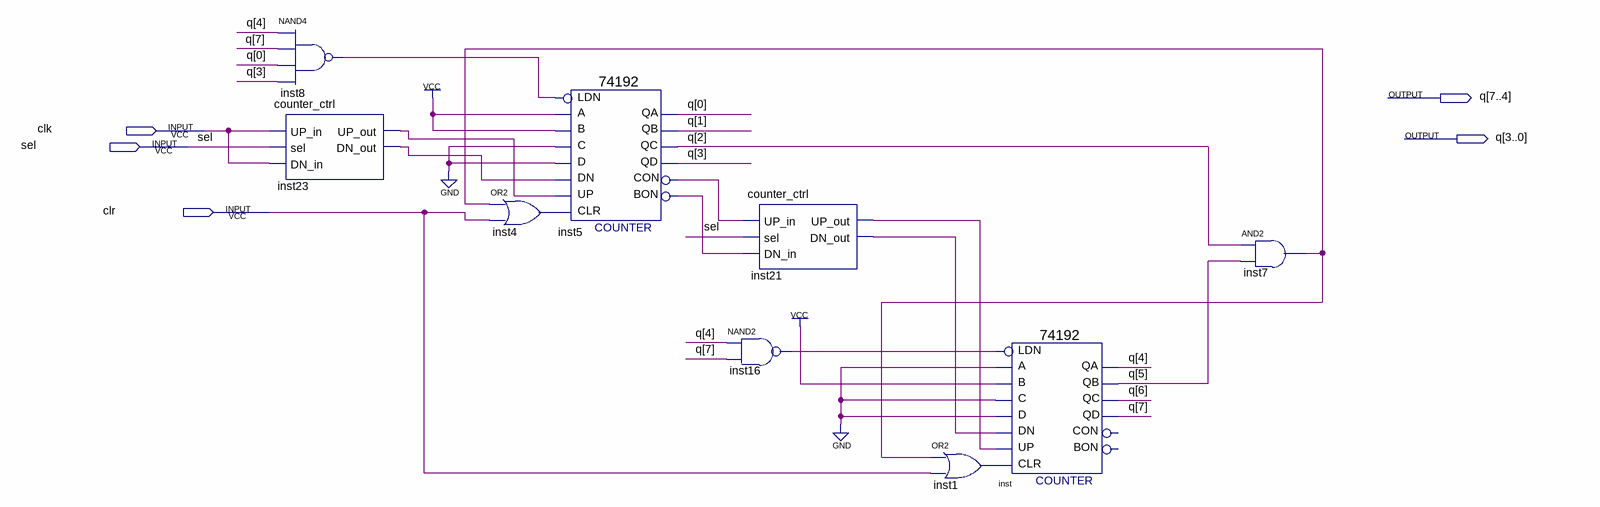
[diagram p0: schematic sheet]
// Quartus schematic counter_24_192.bdf as structural Verilog: 9 symbols, 5 pins
module counter_24_192 (
  input  clk,
  input  sel,
  input  clr,
  output [7:0] q
);

  wire inst1_out, inst4_out, inst5_bon, inst5_con, inst7_out, inst8_out, inst16_out, inst21_dn_out,
       inst21_up_out, inst23_dn_out, inst23_up_out;

  counter_ctrl inst23 (.UP_in(clk), .sel(sel), .DN_in(clk), .UP_out(inst23_up_out), .DN_out(inst23_dn_out));
  nand inst8 (inst8_out, q[4], q[7], q[0], q[3]);
  or inst4 (inst4_out, inst7_out, clr);
  \74192  inst5 (
    .D(1'b0), .C(1'b0), .A(1'b1), .B(1'b1), .CLR(inst4_out), .UP(inst23_up_out), .DN(inst23_dn_out),
    .LDN(inst8_out), .QB(q[1]), .BON(inst5_bon), .CON(inst5_con), .QA(q[0]), .QC(q[2]), .QD(q[3]));
  nand inst16 (inst16_out, q[4], q[7]);
  counter_ctrl inst21 (.UP_in(inst5_con), .sel(sel), .DN_in(inst5_bon), .UP_out(inst21_up_out), .DN_out(inst21_dn_out));
  or inst1 (inst1_out, inst7_out, clr);
  \74192  inst (
    .D(1'b0), .C(1'b0), .A(1'b0), .B(1'b1), .CLR(inst1_out), .UP(inst21_up_out), .DN(inst21_dn_out),
    .LDN(inst16_out), .QB(q[5]), .QA(q[4]), .QC(q[6]), .QD(q[7]));  // open: BON, CON
  and inst7 (inst7_out, q[2], q[5]);
endmodule
